# EAGLE schematic kgopalak_TH (EAGLE 8.3.2)
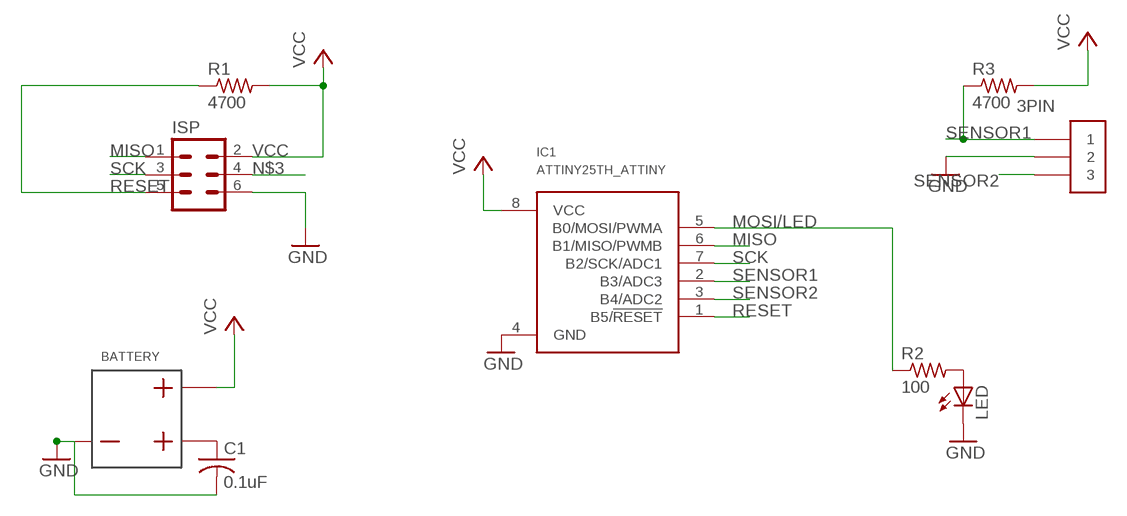
[diagram p0: schematic, sheet 1]

## Parts
3PIN  3PINCONTH_3PIN  [PUSHCON3]
BATTERY  BATTERYTH_BA2032  [BA2032]
C1  0.1uF  CAPACITORTH_CAP  [C025-025X050]
IC1  ATTINY25TH_ATTINY  [DIL08]
ISP  6PINCON_ISPTH_6PIN  [6P2R0.1IN]
LED  LEDTH_LED  [LED5MM]
R1  4700  RESISTORTH_RESISTOR  [0204/7]
R2  100  RESISTORTH_RESISTOR  [0204/7]
R3  4700  RESISTORTH_RESISTOR  [0204/7]

## Nets
GND: 3PIN.2 BATTERY.P$1 C1.2 IC1.4(GND) ISP.6 LED.K(C)
MISO: IC1.6(B1/MISO/PWMB) ISP.1
MOSI/LED: IC1.5(B0/MOSI/PWMA) R2.1
N$1: LED.A R2.2
N$3: ISP.4
N$14: BATTERY.P$3 C1.1
RESET: IC1.1(B5/!RESET) ISP.5 R1.1
SCK: IC1.7(B2/SCK/ADC1) ISP.3
SENSOR1: 3PIN.1 IC1.2(B3/ADC3) R3.1
SENSOR2: 3PIN.3 IC1.3(B4/ADC2)
VCC: BATTERY.P$2 IC1.8(VCC) ISP.2 R1.2 R3.2

## Library data of the parts
3PIN = TinyGadget(1):3PINCON
BATTERY = TinyGadget(1):BATTERY
C1 = TinyGadget(1):CAPACITOR
IC1 = TinyGadget(1):ATTINY25
ISP = TinyGadget(1):6PINCON_ISP
LED = TinyGadget(1):LED
R1-R3 = TinyGadget(1):RESISTOR